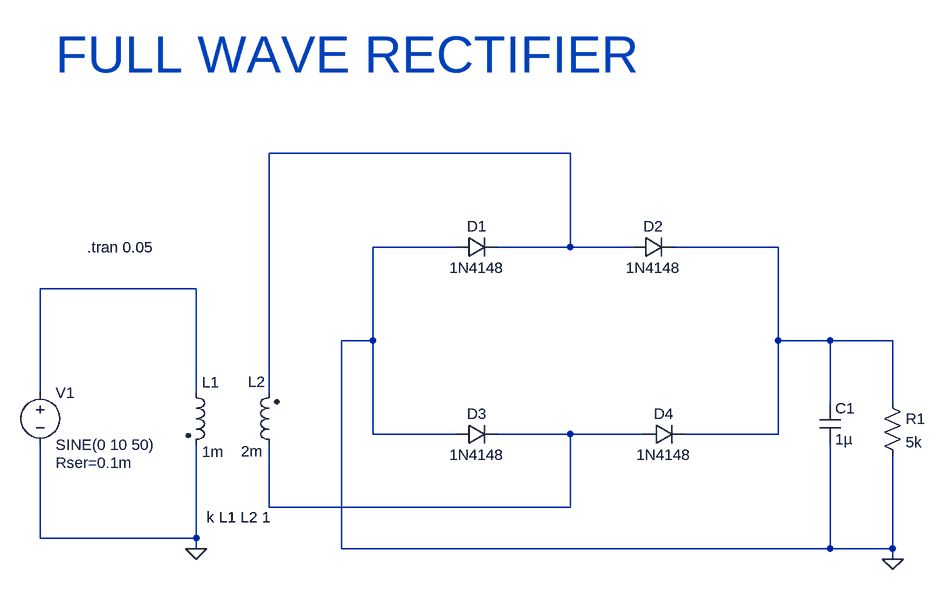
[diagram p0: schematic FULL_WAVE.asc]
FULL_WAVE.asc, the LTspice schematic file:
Version 4
SHEET 1 1352 680
WIRE 800 -224 336 -224
WIRE 624 -80 496 -80
WIRE 800 -80 800 -224
WIRE 800 -80 688 -80
WIRE 896 -80 800 -80
WIRE 1120 -80 960 -80
WIRE 224 -16 -16 -16
WIRE 496 64 496 -80
WIRE 496 64 448 64
WIRE 1120 64 1120 -80
WIRE 1200 64 1120 64
WIRE 1296 64 1200 64
WIRE -16 144 -16 -16
WIRE 224 144 224 -16
WIRE 336 144 336 -224
WIRE 1200 160 1200 64
WIRE 1296 160 1296 64
WIRE 496 208 496 64
WIRE 624 208 496 208
WIRE 800 208 688 208
WIRE 912 208 800 208
WIRE 1120 208 1120 64
WIRE 1120 208 976 208
WIRE 336 320 336 224
WIRE 800 320 800 208
WIRE 800 320 336 320
WIRE -16 368 -16 224
WIRE 224 368 224 224
WIRE 224 368 -16 368
WIRE 224 384 224 368
WIRE 448 384 448 64
WIRE 1200 384 1200 224
WIRE 1200 384 448 384
WIRE 1296 384 1296 240
WIRE 1296 384 1200 384
WIRE 1296 400 1296 384
FLAG 224 384 0
FLAG 1296 400 0
SYMBOL voltage -16 128 R0
WINDOW 123 0 0 Left 0
WINDOW 39 24 124 Left 2
SYMATTR SpiceLine Rser=0.1m
SYMATTR InstName V1
SYMATTR Value SINE(0 10 50)
SYMBOL ind2 208 128 R0
WINDOW 0 25 0 Left 2
WINDOW 3 25 107 Left 2
SYMATTR InstName L1
SYMATTR Value 1m
SYMATTR Type ind
SYMBOL ind2 352 240 R180
WINDOW 0 21 113 Left 2
WINDOW 3 25 6 Left 2
SYMATTR InstName L2
SYMATTR Value 2m
SYMATTR Type ind
SYMBOL diode 624 -64 R270
WINDOW 0 32 32 VTop 2
WINDOW 3 0 32 VBottom 2
SYMATTR InstName D1
SYMATTR Value 1N4148
SYMBOL diode 896 -64 R270
WINDOW 0 32 32 VTop 2
WINDOW 3 0 32 VBottom 2
SYMATTR InstName D2
SYMATTR Value 1N4148
SYMBOL diode 624 224 R270
WINDOW 0 32 32 VTop 2
WINDOW 3 0 32 VBottom 2
SYMATTR InstName D3
SYMATTR Value 1N4148
SYMBOL diode 912 224 R270
WINDOW 0 32 32 VTop 2
WINDOW 3 0 32 VBottom 2
SYMATTR InstName D4
SYMATTR Value 1N4148
SYMBOL res 1280 144 R0
SYMATTR InstName R1
SYMATTR Value 5k
SYMBOL cap 1184 160 R0
SYMATTR InstName C1
SYMATTR Value 1µ
TEXT 240 336 Left 2 !k L1 L2 1
TEXT 56 -80 Left 2 !.tran 0.05
TEXT 8 -376 Left 6 ;FULL WAVE RECTIFIER

The netlist it stands for:
* FULL_WAVE.asc
V1 N003 0 SINE(0 10 50) Rser=0.1m
L1 N003 0 1m
L2 N004 N001 2m
D1 0 N001 1N4148
D2 N001 N002 1N4148
D3 0 N004 1N4148
D4 N004 N002 1N4148
R1 N002 0 5k
C1 N002 0 1µ
.model D D
.lib standard.dio
k L1 L2 1
.tran 0.05
* FULL WAVE RECTIFIER
.backanno
.end